# EAGLE design KeepUntil-v1.0.0 (EAGLE 7.5.0)
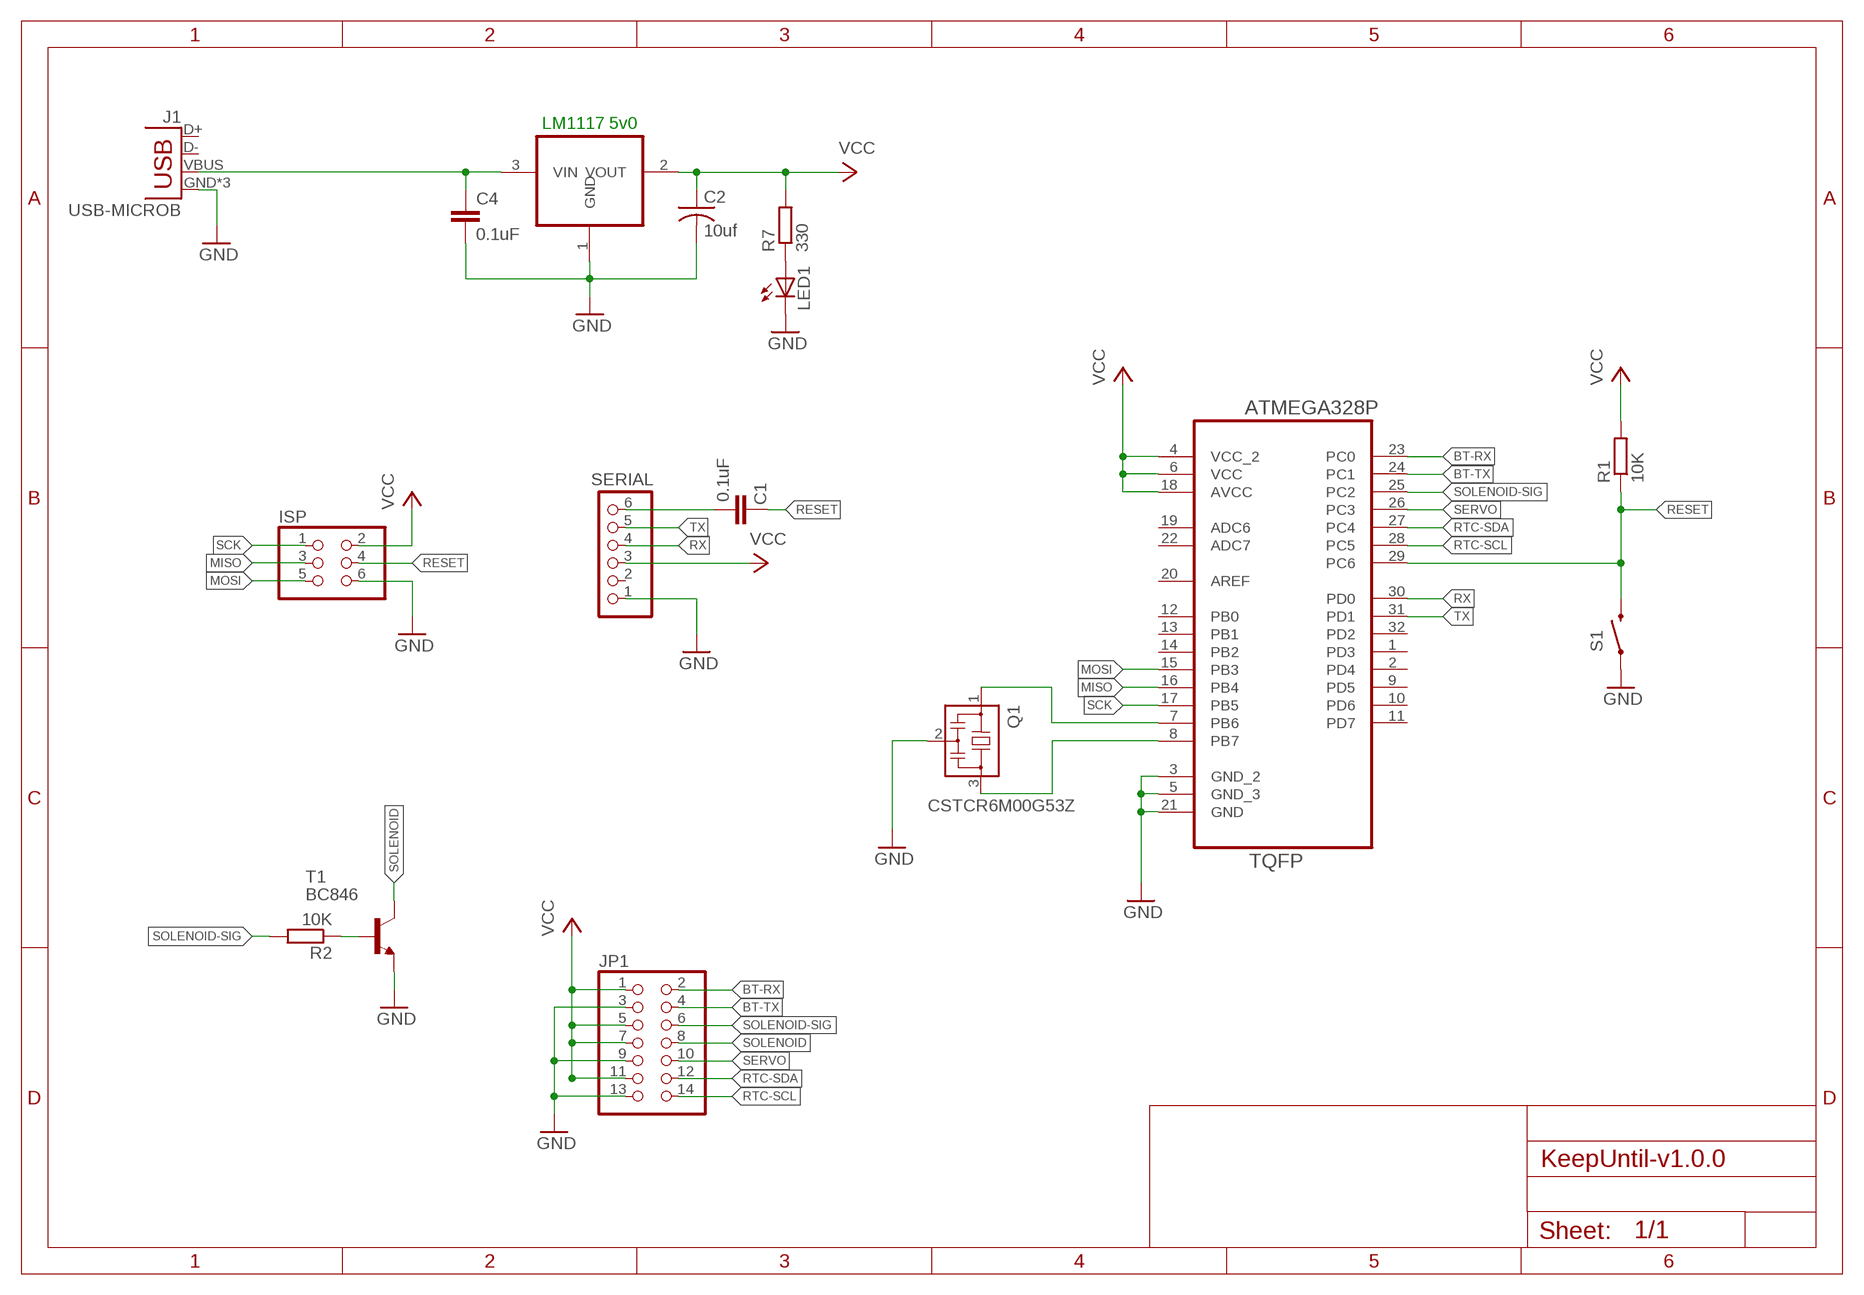
[diagram p0: schematic, sheet 1]

## Parts
C1  0.1uF  C-EUC0805  [C0805]
C2  10uf  C-USC1206  [C1206]
C4  0.1uF  C-EUC0805  [C0805]
IC2  REG1117  [SOT223]
ISP  PINHD-2X3  [2X03]
J1  USB-MICROB  [USB-MICROB]
JP1  PINHD-2X7  [2X07]
LED1  LEDSMT1206  [1206]
Q1  CSTCR6M00G53Z  [CSTCR6M]
R1  10K  R-EU_R0805  [R0805]
R2  10K  R-EU_R0805  [R0805]
R7  330  R-EU_R0805  [R0805]
S1  SWITCH-MOMENTARY-2SMD-1101NE  [TACTILE-SWITCH-1101NE]
SERIAL  PINHD-1X6  [1X06]
T1  BC846  [SOT23]
U1  ATMEGA328P-AU  [QFP80P900X900X120-32N]

## Nets
BT-RX: JP1.2 U1.23(PC0)
BT-TX: JP1.4 U1.24(PC1)
GND: C2.2 C4.2 IC2.1(GND) ISP.6 J1.GND J1.MT1(GND) J1.MT2(GND) JP1.3 JP1.9 JP1.13 LED1.C Q1.2 S1.1 SERIAL.1 T1.2(E) U1.3(GND_2) U1.5(GND_3) U1.21(GND)
MISO: ISP.3 U1.16(PB4)
MOSI: ISP.5 U1.15(PB3)
N$1: Q1.1 U1.7(PB6)
N$2: Q1.3 U1.8(PB7)
N$3: R2.1 T1.1(B)
N$4: C4.1 IC2.3(VIN) J1.VBUS
N$7: LED1.A R7.1
N$17: C1.2 SERIAL.6
RESET: C1.1 ISP.4 R1.1 S1.2 U1.29(PC6)
RTC-SCL: JP1.14 U1.28(PC5)
RTC-SDA: JP1.12 U1.27(PC4)
RX: SERIAL.4 U1.30(PD0)
SCK: ISP.1 U1.17(PB5)
SERVO: JP1.10 U1.26(PC3)
SOLENOID: JP1.8 T1.3(C)
SOLENOID-SIG: JP1.6 R2.2 U1.25(PC2)
TX: SERIAL.5 U1.31(PD1)
VCC: C2.1 IC2.2(VOUT) ISP.2 JP1.1 JP1.5 JP1.7 JP1.11 R1.2 R7.2 SERIAL.3 U1.4(VCC_2) U1.6(VCC) U1.18(AVCC)
Unconnected: J1.D+ J1.D- SERIAL.2 U1.1(PD3) U1.2(PD4) U1.9(PD5) U1.10(PD6) U1.11(PD7) U1.12(PB0) U1.13(PB1) U1.14(PB2) U1.19(ADC6) U1.20(AREF) U1.22(ADC7) U1.32(PD2)

## Notes on the sheet
- LM1117 5v0

## Library data of the parts
C1 C4 = resistor:C-EU: CAPACITOR, European symbol
C2 = resistor:C-US: CAPACITOR, American symbol
IC2 = burr-brown:REG1117: 800mA and 1A Low Dropout (LDO) Positive Regulator 1.8V, 2.5V, 2.85V, 3.3V, 5V, and Adj; MPN: LM1117 3v3; OC_FARNELL: 1097566; OC_NEWARK: 14P6981
ISP = pinhead:PINHD-2X3: PIN HEADER
J1 = SparkFun-Connectors:USB: USB Connectors USB-B-PTH is fully proven SKU : PRT-00139/CONN-08278 USB-miniB is fully proven SKU : PRT-00587 USB-A-PCB is untested. USB-A-H is throughly reviewed, but untested. Spark Fun Electronics SKU : PRT-00437 USB-B-SMT is throughly reviewed, but untested. Needs silkscreen touching up. USB-A-S has not been used/tested USB-MB-H has not been used/tested USB-MICROB has been used. CONN-09505; PROD_ID: CONN-09505
JP1 = pinhead:PINHD-2X7: PIN HEADER
LED1 = led:LED: LED OSRAM: - CHIPLED LG R971, LG N971, LY N971, LG Q971, LY Q971, LO R971, LY R971 LH N974, LH R974 LS Q976, LO Q976, LY Q976 LO Q996 - Hyper CHIPLED LW Q18S LB Q993, LB Q99A, LB R99A - SideLED LS A670, LO A670, LY A670, LG A670, LP A670 LB A673, LV A673, LT A673, LW A673 LH A674 LY A675 LS A676, LA A676, LO A676, LY A676, LW A676 LS A679, LY A679, LG A679 - Hyper Micro SIDELED® LS Y876, LA Y876, LO Y876, LY Y876 LT Y87S - SmartLED LW L88C, LW L88S LB L89C, LB L89S, LG L890 LS L89K, LO L89K, LY L89K LS L896, LA L896, LO L896, LY L896 - TOPLED LS T670, LO T670, LY T670, LG T670, LP T670 LSG T670, LSP T670, LSY T670, LOP T670, LYG T670 LG T671, LOG T671, LSG T671 LB T673, LV T673, LT T673, LW T673 LH T674 LS T676, LA T676, LO T676, LY T676, LB T676, LH T676, LSB T676, LW T676 LB T67C, LV T67C, LT T67C, LS T67K, LO T67K, LY T67K, LW E67C LS E67B, LA E67B, LO E67B, LY E67B, LB E67C, LV E67C, LT E67C LW T67C LS T679, LY T679, LG T679 LS T770, LO T770, LY T770, LG T770, LP T770 LB T773, LV T773, LT T773, LW T773 LH T774 LS E675, LA E675, LY E675, LS T675 LS T776, LA T776, LO T776, LY T776, LB T776 LHGB T686 LT T68C, LB T68C - Hyper Mini TOPLED® LB M676 - Mini TOPLED Santana® LG M470 LS M47K, LO M47K, LY M47K Source: http://www.osram.convergy.de LUXEON: - LUMILED® LXK2-PW12-R00, LXK2-PW12-S00, LXK2-PW14-U00, LXK2-PW14-V00 LXK2-PM12-R00, LXK2-PM12-S00, LXK2-PM14-U00 LXK2-PE12-Q00, LXK2-PE12-R00, LXK2-PE12-S00, LXK2-PE14-T00, LXK2-PE14-U00 LXK2-PB12-K00, LXK2-PB12-L00, LXK2-PB12-M00, LXK2-PB14-N00, LXK2-PB14-P00, LXK2-PB14-Q00 LXK2-PR12-L00, LXK2-PR12-M00, LXK2-PR14-Q00, LXK2-PR14-R00 LXK2-PD12-Q00, LXK2-PD12-R00, LXK2-PD12-S00 LXK2-PH12-R00, LXK2-PH12-S00 LXK2-PL12-P00, LXK2-PL12-Q00, LXK2-PL12-R00 Source: www.luxeon.com KINGBRIGHT: KA-3528ASYC Source: www.kingbright.com
Q1 = murata-filter:CSTCR: Resonator Source: murata.co.jp; MPN: CSTCR6M00G53-R0; OC_FARNELL: 1170434; OC_NEWARK: 25M8759
R1 R2 R7 = resistor:R-EU_: RESISTOR, European symbol
S1 = SparkFun-Electromechanical:SWITCH-MOMENTARY-2: Various NO switches- pushbuttons, reed, etc; PROD_ID: SWCH-00815
SERIAL = pinhead:PINHD-1X6: PIN HEADER
T1 = transistor:BC846: NPN TRANSISTOR
U1 = Ava:ATMEGA328P-AU; DESCRIPTION: 8-bit Microcontroller with In-System Programmable Flash; MPN: ATMEGA328P-AU; OC_FARNELL: 1715486; OC_NEWARK: 14R4631; PACKAGE: TQFP-32; SUPPLIER: Atmel

## Board
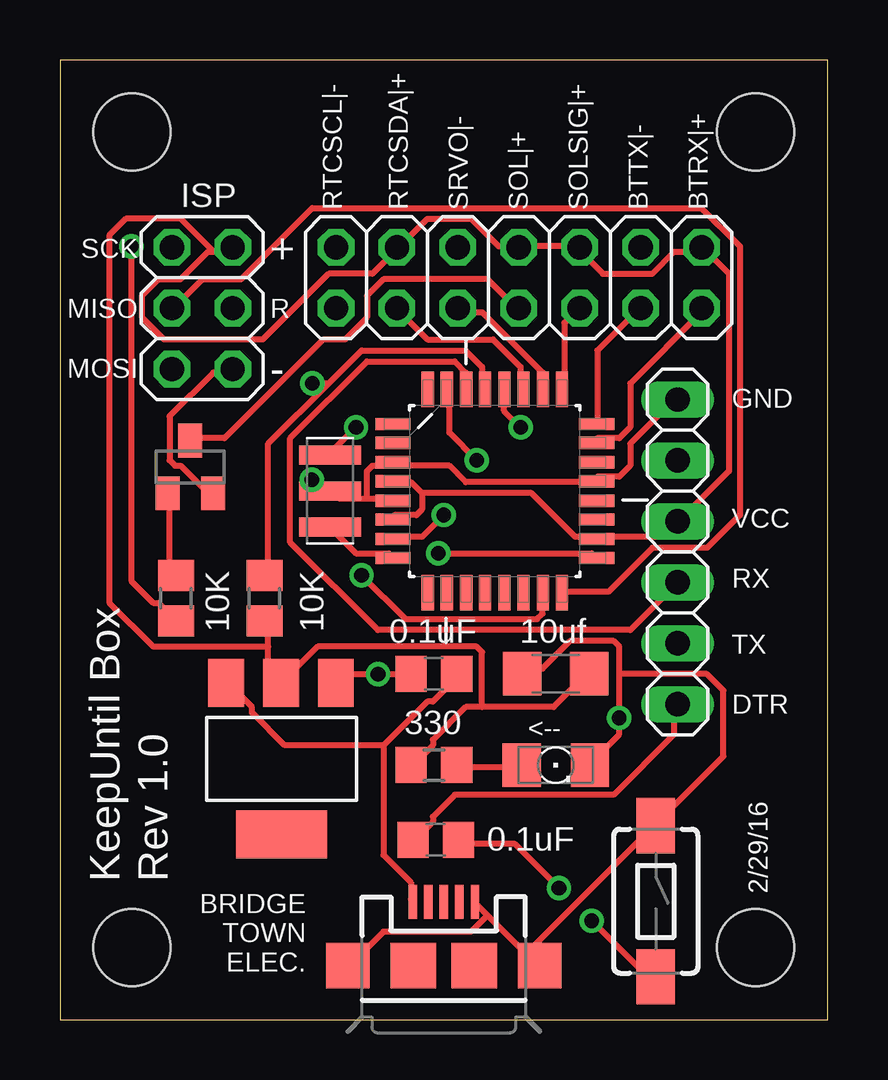
[diagram p1: board, top side]
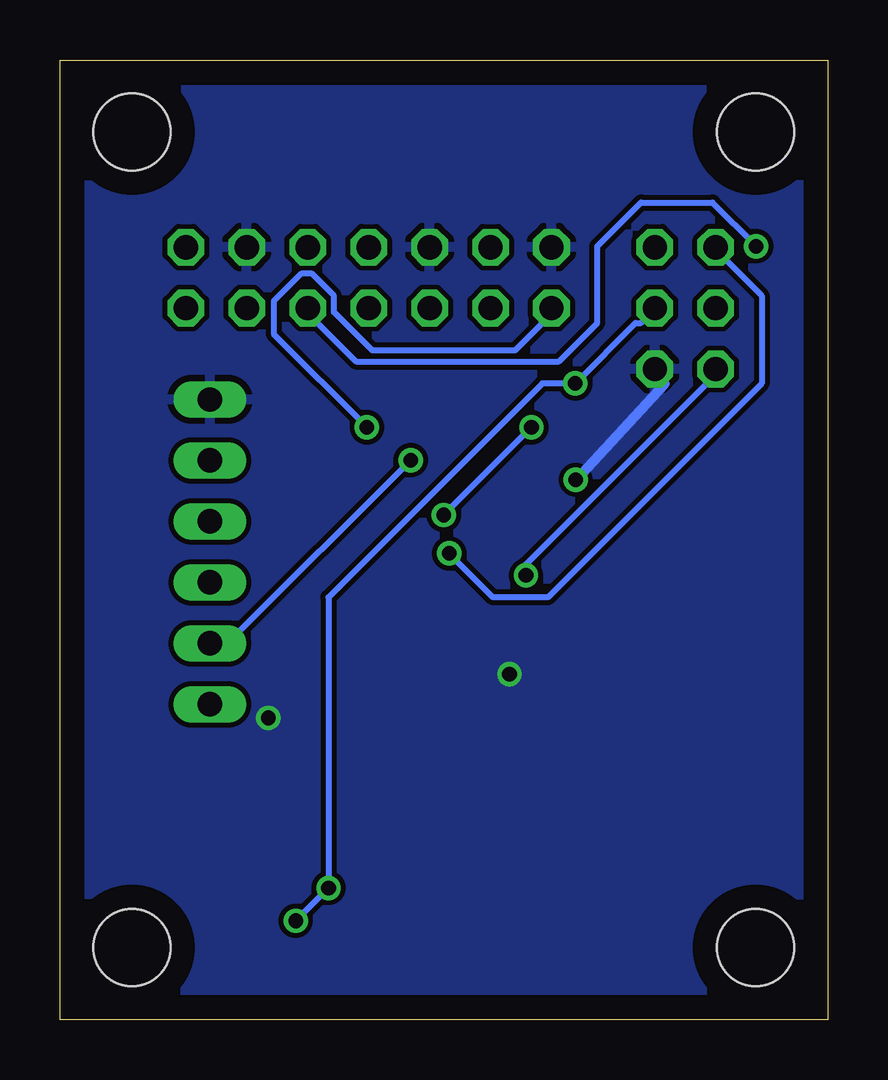
[diagram p2: board, bottom side, seen from below]

Size 32 x 40 mm. Coordinates in mm from the lower left corner, seen from the top.
Outline: 0,0 32,0 32,40 0,40 0,0
Copper layers (1*16): Top 0.035mm / dielectric 1.5mm / Bottom 0.035mm
Design rules "default": minimum track width 10mil, minimum drill 24mil, track to track 8mil, track to pad 8mil, pad to pad 8mil, via to via 8mil, smd to smd 8mil, copper to edge 40mil, drill to drill 8mil, minimum pad ring 10mil, minimum via ring 8mil, stop-mask expansion 4mil, vias tented up to drill 0mil, thermal gap 10mil
Holes 3.2 mm at 3,37 3,3 29,37 29,3

### Footprints (pad centres in the part's own frame; a part is rotated, then mirrored left to right if it is on the bottom)
C0805 = smd 1.3 x 1.5: 1 -0.95,0; 2 0.95,0
C1206 = smd 1.6 x 1.8: 1 -1.4,0; 2 1.4,0
SOT223 = smd 1.499 x 2.007: 1 -2.261,-3.15; 2 0.025,-3.15; 3 2.311,-3.15 | smd 3.81 x 2.007: 4 0,3.15
2X03 = drill 1.016 octagon: 1 -2.54,-1.27; 2 -2.54,1.27; 3 0,-1.27; 4 0,1.27; 5 2.54,-1.27; 6 2.54,1.27
USB-MICROB = smd 0.35 x 1.4: D+ 0,2.65; D- -0.65,2.65; GND 1.3,2.65; ID 0.65,2.65; VBUS -1.3,2.65 | smd 1.8 x 1.9: MT1 -4,0; MT2 4,0 | smd 1.9 x 1.9: P$1 -1.27,0; P$2 1.27,0
2X07 = drill 1.016 octagon: 1 -7.62,-1.27; 2 -7.62,1.27; 3 -5.08,-1.27; 4 -5.08,1.27; 5 -2.54,-1.27; 6 -2.54,1.27; 7 0,-1.27; 8 0,1.27; 9 2.54,-1.27; 10 2.54,1.27; 11 5.08,-1.27; 12 5.08,1.27; 13 7.62,-1.27; 14 7.62,1.27
1206 = smd 1.6 x 1.803: A -1.422,0; C 1.422,0
CSTCR6M = smd 0.8 x 2.6: 1 -1.5,0; 2 0,0; 3 1.5,0
R0805 = smd 1.3 x 1.5: 1 -0.95,0; 2 0.95,0
TACTILE-SWITCH-1101NE = smd 2.3 x 1.6: 1 -3.15,0; 2 3.15,0
1X06 = drill 1.016 long: 1 -6.35,0; 2 -3.81,0; 3 -1.27,0; 4 1.27,0; 5 3.81,0; 6 6.35,0
SOT23 = smd 1 x 1.4: 1 -0.95,-1.1; 2 0.95,-1.1; 3 0,1.1
QFP80P900X900X120-32N = smd 1.473 x 0.508: 1 -4.242,2.794; 2 -4.242,2.007; 3 -4.242,1.194; 4 -4.242,0.406; 5 -4.242,-0.406; 6 -4.242,-1.194; 7 -4.242,-2.007; 8 -4.242,-2.794; 17 4.242,-2.794; 18 4.242,-2.007; 19 4.242,-1.194; 20 4.242,-0.406; 21 4.242,0.406; 22 4.242,1.194; 23 4.242,2.007; 24 4.242,2.794 | smd 0.508 x 1.473: 9 -2.794,-4.242; 10 -2.007,-4.242; 11 -1.194,-4.242; 12 -0.406,-4.242; 13 0.406,-4.242; 14 1.194,-4.242; 15 2.007,-4.242; 16 2.794,-4.242; 25 2.794,4.242; 26 2.007,4.242; 27 1.194,4.242; 28 0.406,4.242; 29 -0.406,4.242; 30 -1.194,4.242; 31 -2.007,4.242; 32 -2.794,4.242

### Placement (x,y rotation side)
C1  15.66,7.5 180 top
C2  20.67,14.41 180 top
C4  15.59,14.41 180 top
IC2  9.24,10.88 180 top
ISP  5.93,29.66 270 top
J1  16,2.25 0 top
JP1  19.13,30.93 180 top
LED1  20.67,10.61 0 top
Q1  11.26,22.04 270 top
R1  8.53,17.57 270 top
R2  4.84,17.57 270 top
R7  15.59,10.61 180 top
S1  24.84,4.93 270 top
SERIAL  25.75,19.5 270 top
T1  5.43,23.04 0 top
U1  18.13,22.04 0 top

### Tracks (layer width: path | path; a pad name or v marks a point on that pad's centre or on a via)
BT-RX
  Top 0.254: U1.23 22.4,24.23 23.32,24.23 23.77,24.69 23.77,26.52 26.75,29.49 JP1.2
BT-TX
  Top 0.254: U1.24 22.4,24.92 22.4,27.89 24,29.49 JP1.4
GND  (via drill 0.6, 0.61)
  Top 0.254: 23.32,14.4 v23.32,12.57 23.32,11.89 22.17,10.74 LED1.C | 23.32,14.4 23.32,15.54 23.09,15.77 21.26,15.77 20.12,14.63 19.43,14.63 C2.2 | 19.43,2.74 19.89,2.29 J1.MT2 19.43,2.74 | 19.43,2.74 17.83,4.34 | 17.83,4.34 17.37,4.8 J1.GND | 17.83,4.34 17.14,3.66 13.49,3.66 12.12,2.29 J1.MT1 | 19.43,2.74 24.69,8 S1.1 24.92,8.23 27.66,10.97 27.66,13.72 26.98,14.4 23.32,14.4 | 12.8,21.72 11.66,21.72 11.43,21.95 Q1.2 | 12.8,21.72 13.72,21.72 U1.5 | 12.8,21.72 12.8,22.86 13.03,23.09 13.72,23.09 U1.3 13.95,23.09 16.23,23.09 16.92,22.4 22.17,22.4 U1.21 22.4,22.63 23.32,22.63 23.77,23.09 23.77,24 25.6,25.83 SERIAL.1 | C4.2 v13.26,14.4 11.89,14.4 11.66,14.17 IC2.1 | T1.2 6.17,21.95 5.03,23.09 4.8,23.09 4.57,23.32 4.57,25.15 6.4,26.98 7.09,26.98 ISP.6
  Top 0.406: Q1.2 11,22.04 11,22 10.5,22 v10.5,22.5
  Bottom 0.406: v10.5,22.5 6.8,26.5 ISP.6
  pour Bottom: 0,0 32,0 32,40 0,40
MISO
  Top 0.254: U1.16 21.03,17.83 22.86,17.83 24.69,19.66 26.98,19.66 28.35,21.03 28.35,32.23 26.75,33.83 10.52,33.83 7.54,30.86 5.94,30.86 4.8,29.72 ISP.3
MOSI  (via drill 0.61)
  Top 0.254: v12.57,18.52 14.4,16.69 19.89,16.69 20.12,16.92 20.12,17.6 U1.15
  Bottom 0.254: v12.57,18.52 12.57,18.97 4.57,26.98 ISP.5
N$1  (via drill 0.61)
  Top 0.254: v16,21.03 15.09,20.12 13.95,20.12 U1.7 | v12.34,24.69 11.2,23.55 Q1.1
  Bottom 0.254: v12.34,24.69 v16,21.03
N$2
  Top 0.254: U1.8 13.72,19.43 12.34,19.43 11.43,20.34 Q1.3
N$3
  Top 0.254: T1.1 4.57,21.72 4.57,18.75 4.8,18.52 R2.1
N$4
  Top 0.254: 13.49,11.43 13.49,6.86 14.63,5.71 14.63,5.03 J1.VBUS | 13.49,11.43 15.32,13.26 15.54,13.26 16.69,14.4 C4.1 | 13.49,11.43 9.37,11.43 8,12.8 8,13.03 7.09,13.95 IC2.3
N$5  (via drill 0.6)
  other vias: 10.5,22.5
N$7
  Top 0.254: R7.1 16.69,10.52 19.2,10.52 LED1.A
N$17
  Top 0.254: C1.2 14.86,7.54 15.54,8.23 15.54,8.46 16.46,9.37 23.09,9.37 25.6,11.89 25.6,13.03 SERIAL.6
RESET  (via drill 0.61)
  Top 0.254: v20.8,5.49 18.97,7.32 16.69,7.32 C1.1 | v22.17,4.12 24.69,1.6 S1.2 | 11.2,26.52 8.69,24 8.69,18.52 R1.1 | 11.2,26.52 12.57,27.89 16.92,27.89 17.6,27.2 17.6,26.29 U1.29 | 11.2,26.52 v10.52,26.52
  Bottom 0.254: v22.17,4.12 v20.8,5.49 20.8,17.6 11.89,26.52 v10.52,26.52 8,29.03 7.77,29.03 7.32,29.49 ISP.4
RTC-SCL  (via drill 0.61)
  Top 0.254: v19.2,24.69 18.52,25.38 18.52,26.06 U1.28
  Bottom 0.254: v19.2,24.69 23.09,28.57 23.09,29.95 21.95,31.09 21.49,31.09 20.57,30.18 20.57,29.49 18.97,27.89 13.03,27.89 11.43,29.49 JP1.14
RTC-SDA
  Top 0.254: U1.27 19.2,26.29 19.2,27.2 18.06,28.35 15.32,28.35 14.17,29.49 JP1.12
RX
  Top 0.254: U1.30 16.92,26.29 16.92,26.98 16.46,27.43 12.8,27.43 9.6,24.23 9.6,19.89 13.26,16.23 23.77,16.23 25.6,18.06 SERIAL.4
SCK  (via drill 0.61)
  Top 0.254: v15.77,19.43 22.17,19.43 U1.17
  Bottom 0.254: v15.77,19.43 13.95,17.6 11.66,17.6 2.74,26.52 2.74,30.18 4.57,32 ISP.1
SERVO
  Top 0.254: U1.26 20.12,26.29 20.12,26.98 17.6,29.49 16.69,29.49 JP1.10
SOLENOID
  Top 0.254: T1.3 5.49,24.23 6.86,24.23 10.97,28.35 11.89,28.35 12.8,29.26 12.8,30.18 13.49,30.86 17.83,30.86 18.97,29.72 JP1.8
SOLENOID-SIG  (via drill 0.61)
  Top 0.254: U1.25 21.03,26.29 21.03,29.03 21.49,29.49 JP1.6 | v2.97,32.23 2.97,18.29 3.89,17.37 4.12,17.37 4.8,16.69 R2.2
  Bottom 0.254: v2.97,32.23 4.8,34.06 7.77,34.06 9.6,32.23 9.6,29.03 11.2,27.43 19.66,27.43 21.72,29.49 JP1.6
TX  (via drill 0.61)
  Top 0.254: v17.37,23.32 16.23,24.46 16.23,26.06 U1.31
  Bottom 0.254: v17.37,23.32 24.92,15.77 25.6,15.77 SERIAL.5
VCC
  Top 0.254: 8.69,15.54 8.69,14.63 9.14,14.17 IC2.2 9.37,14.17 10.74,15.54 17.37,15.54 17.6,15.32 17.6,13.03 | 8.69,15.54 8.69,16.46 R1.2 | 17.6,13.03 20.57,13.03 21.95,14.4 C2.1 | 17.6,13.03 16.92,13.03 15.54,11.66 15.54,11.43 14.86,10.74 R7.2 | 15.09,21.95 15.09,21.26 14.86,21.03 13.95,21.03 U1.6 | 15.09,21.95 14.63,22.4 13.95,22.4 U1.4 | 15.09,21.95 19.66,21.95 21.49,20.12 22.17,20.12 U1.18 22.4,20.12 25.15,20.12 25.6,20.57 SERIAL.3 25.83,20.8 27.89,22.86 27.89,31.09 26.98,32 JP1.1 26.75,32 25.6,32 24.69,31.09 22.63,31.09 21.72,32 JP1.5 21.49,32.23 19.2,32.23 JP1.7 18.97,32.23 18.29,32.23 17.14,33.38 15.32,33.38 14.17,32.23 JP1.11 13.95,32 13.03,31.09 11.2,31.09 8.46,28.35 4.34,28.35 3.43,29.26 3.43,30.18 4.12,30.86 5.03,30.86 6.17,32 6.4,32 | 6.4,32 7.09,32 ISP.2 | 8.69,15.54 3.89,15.54 2.06,17.37 2.06,32.69 2.74,33.38 5.03,33.38 6.4,32

### Text on the board
tPlace: RTCSCL|- | RTCSDA|+ | SRVO|- | SOL|+ | SOLSIG|+ | BTTX|- | BTRX|+ | SCK | + | MISO | R | MOSI | - | GND | VCC | RX | TX | DTR | <-- | KeepUntil Box | Rev 1.0 | 2/29/16 | BRIDGE / TOWN / ELEC.